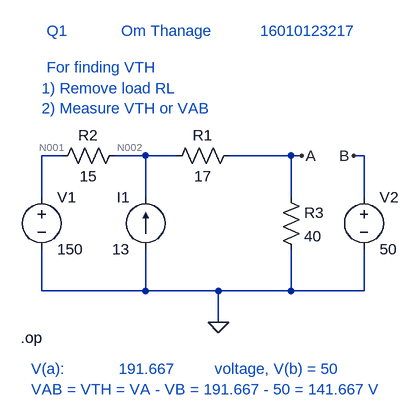
[diagram p0: schematic Draft1.asc]
Draft1.asc, the LTspice schematic file:
Version 4
SHEET 1 880 680
WIRE -1280 32 -1312 32
WIRE -1152 32 -1200 32
WIRE -1104 32 -1152 32
WIRE -928 32 -1024 32
WIRE -912 32 -928 32
WIRE -816 32 -832 32
WIRE -1312 96 -1312 32
WIRE -1152 96 -1152 32
WIRE -928 96 -928 32
WIRE -816 96 -816 32
WIRE -1312 240 -1312 176
WIRE -1152 240 -1152 176
WIRE -1152 240 -1312 240
WIRE -1040 240 -1152 240
WIRE -928 240 -928 176
WIRE -928 240 -1040 240
WIRE -816 240 -816 176
WIRE -816 240 -928 240
WIRE -1040 288 -1040 240
FLAG -912 32 A
FLAG -832 32 B
FLAG -1040 288 0
SYMBOL voltage -1312 80 R0
WINDOW 123 0 0 Left 0
WINDOW 39 0 0 Left 0
SYMATTR InstName V1
SYMATTR Value 150
SYMBOL voltage -816 80 R0
WINDOW 123 0 0 Left 0
WINDOW 39 0 0 Left 0
SYMATTR InstName V2
SYMATTR Value 50
SYMBOL current -1152 176 R180
WINDOW 0 24 80 Left 2
WINDOW 3 24 0 Left 2
WINDOW 123 0 0 Left 0
WINDOW 39 0 0 Left 0
SYMATTR InstName I1
SYMATTR Value 13
SYMBOL res -1008 16 R90
WINDOW 0 0 56 VBottom 2
WINDOW 3 32 56 VTop 2
SYMATTR InstName R1
SYMATTR Value 17
SYMBOL res -1184 16 R90
WINDOW 0 0 56 VBottom 2
WINDOW 3 32 56 VTop 2
SYMATTR InstName R2
SYMATTR Value 15
SYMBOL res -944 80 R0
SYMATTR InstName R3
SYMATTR Value 40
TEXT -1344 312 Left 2 !.op
TEXT -1304 -160 Left 2 ;Q1            Om Thanage
TEXT -976 -160 Left 2 ;16010123217
TEXT -1304 -104 Left 2 ;For finding VTH
TEXT -1312 -72 Left 2 ;1) Remove load RL\n2) Measure VTH or VAB
TEXT -1328 360 Left 2 ;V(a):            191.667         voltage, V(b) = 50\nVAB = VTH = VA - VB = 191.667 - 50 = 141.667 V

The netlist it stands for:
* Draft1.asc
V1 N001 0 150
V2 B 0 50
I1 0 N002 13
R1 A N002 17
R2 N002 N001 15
R3 A 0 40
.op
* Q1            Om Thanage
* 16010123217
* For finding VTH
* 1) Remove load RL
* 2) Measure VTH or VAB
* V(a):            191.667         voltage, V(b) = 50
* VAB = VTH = VA - VB = 191.667 - 50 = 141.667 V
.backanno
.end

* Results of the author's LTspice run, read from the files saved beside the schematic
* Operating Point:
*   V(n001) = 150 V
*   V(b) = 50 V
*   V(n002) = 273.1 V
*   V(a) = 191.7 V
*   I(I1) = 13 A
*   I(R1) = -4.792 A
*   I(R2) = 8.208 A
*   I(R3) = 4.792 A
*   I(V1) = 8.208 A
*   I(V2) = 0 A